# EAGLE schematic SparkySpecialK (EAGLE 6.5.0)
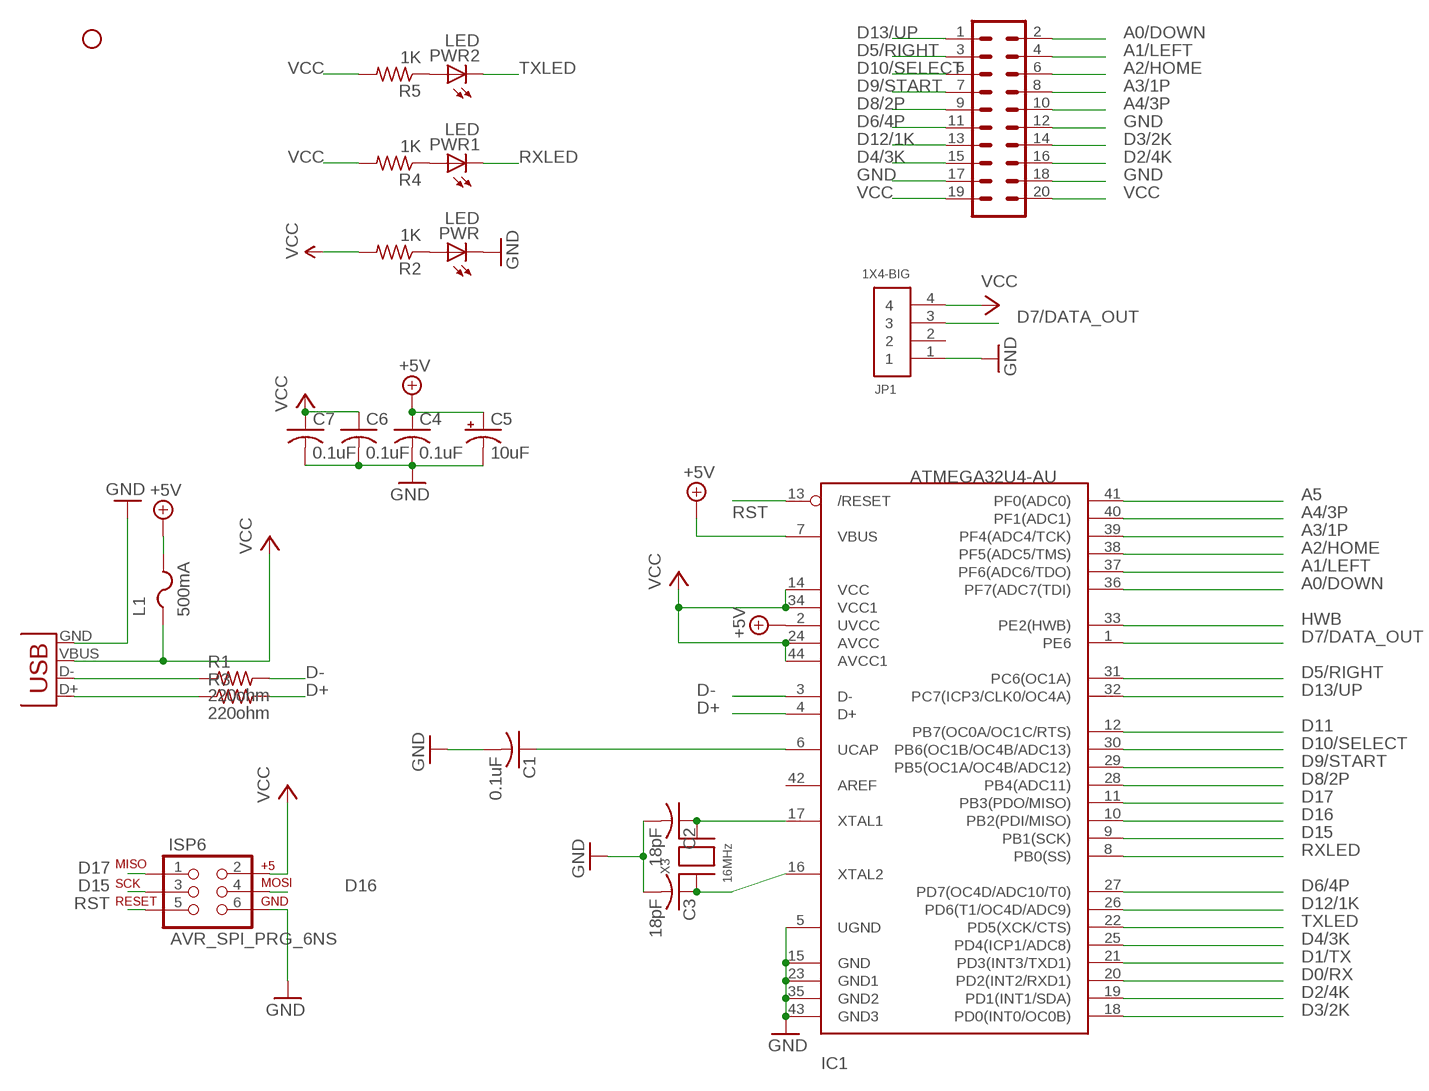
[diagram p0: schematic, sheet 1]

## Parts
C1  0.1uF  C-USC0805K  [C0805K]
C2  18pF  C-USC0805K  [C0805K]
C3  18pF  C-USC0805K  [C0805K]
C4  0.1uF  C-USC0805K  [C0805K]
C5  10uF  CPOL-USA/3216-18R  [A/3216-18R]
C6  0.1uF  C-USC0805K  [C0805K]
C7  0.1uF  C-USC0805K  [C0805K]
CN1  MiniB USB  USBSMD  [USB-MINIB]
IC1  ATMEGA32U4-AU  [TQFP44]
ISP6  AVR_SPI_PRG_6NS  [2X3-NS]
JP1  1X4-BIG  [1X04-BIG]
JP2  STAND-OFF  [STAND-OFF]
L1  500mA  PTCFUSE-1206  [R1206]
PWR  LED  LEDCHIPLED_0805  [CHIPLED_0805]
PWR1  LED  LEDCHIPLED_0805  [CHIPLED_0805]
PWR2  LED  LEDCHIPLED_0805  [CHIPLED_0805]
R1  220ohm  R-US_R0805  [R0805]
R2  1K  R-US_R0805  [R0805]
R3  220ohm  R-US_R0805  [R0805]
R4  1K  R-US_R0805  [R0805]
R5  1K  R-US_R0805  [R0805]
U$1  M10X2NOSILK  [2X10_NOSILK]
X3  16MHz  XTALNX5032  [NX5032]

## Nets
+5V: C4.1 C5.+ IC1.2(UVCC) IC1.7(VBUS) L1.2
A0/DOWN: IC1.36(PF7(ADC7(TDI)) U$1.2
A1/LEFT: IC1.37(PF6(ADC6/TDO)) U$1.4
A2/HOME: IC1.38(PF5(ADC5/TMS)) U$1.6
A3/1P: IC1.39(PF4(ADC4/TCK)) U$1.8
A4/3P: IC1.40(PF1(ADC1)) U$1.10
A5: IC1.41(PF0(ADC0))
D0/RX: IC1.20(PD2(INT2/RXD1))
D1/TX: IC1.21(PD3(INT3/TXD1))
D2/4K: IC1.19(PD1(INT1/SDA)) U$1.16
D3/2K: IC1.18(PD0(INT0/OC0B)) U$1.14
D4/3K: IC1.25(PD4(ICP1/ADC8)) U$1.15
D5/RIGHT: IC1.31(PC6(OC1A)) U$1.3
D6/4P: IC1.27(PD7(OC4D/ADC10/T0)) U$1.11
D7/DATA_OUT: IC1.1(PE6) JP1.3
D8/2P: IC1.28(PB4(ADC11)) U$1.9
D9/START: IC1.29(PB5(OC1A/OC4B/ADC12)) U$1.7
D10/SELECT: IC1.30(PB6(OC1B/OC4B/ADC13)) U$1.5
D11: IC1.12(PB7(OC0A/OC1C/RTS))
D12/1K: IC1.26(PD6(T1/OC4D/ADC9)) U$1.13
D13/UP: IC1.32(PC7(ICP3/CLK0/OC4A)) U$1.1
D15: IC1.9(PB1(SCK)) ISP6.3
D16: IC1.10(PB2(PDI/MISO)) ISP6.4
D17: IC1.11(PB3(PDO/MISO)) ISP6.1
D+: IC1.4(D+) R3.2
D-: IC1.3(D-) R1.2
GND: C1.2 C2.2 C3.2 C4.2 C5.- C6.2 C7.2 CN1.GND IC1.5(UGND) IC1.15(GND) IC1.23(GND1) IC1.35(GND2) IC1.43(GND3) ISP6.6 JP1.1 PWR.C U$1.12 U$1.17 U$1.18
HWB: IC1.33(PE2(HWB))
N$2: PWR.A R2.1
N$3: CN1.D+ R3.1
N$4: C1.1 IC1.6(UCAP)
N$5: CN1.D- R1.1
N$6: PWR1.A R4.1
N$7: PWR2.A R5.1
N$8: C2.1 IC1.17(XTAL1) X3.P$2
N$9: C3.1 IC1.16(XTAL2) X3.P$1
RST: IC1.13(/RESET) ISP6.5
RXLED: IC1.8(PB0(SS)) PWR1.C
TXLED: IC1.22(PD5(XCK/CTS)) PWR2.C
VCC: C6.1 C7.1 CN1.VBUS IC1.14(VCC) IC1.24(AVCC) IC1.34(VCC1) IC1.44(AVCC1) ISP6.2 JP1.4 L1.1 R2.2 R4.2 R5.2 U$1.19 U$1.20
Unconnected: IC1.42(AREF) JP1.2

## Library data of the parts
C1-C4 C6 C7 = adafruit:C-US: CAPACITOR, American symbol
C5 = adafruit:CPOL-US: POLARIZED CAPACITOR, American symbol
CN1 = SparkFun-Connectors:USB: USB Connectors USB-B-PTH is fully proven SKU : PRT-00139/CONN-08278 USB-miniB is fully proven SKU : PRT-00587 USB-A-PCB is untested. USB-A-H is throughly reviewed, but untested. Spark Fun Electronics SKU : PRT-00437 USB-B-SMT is throughly reviewed, but untested. Needs silkscreen touching up. USB-A-S has not been used/tested USB-MB-H has not been used/tested USB-MICROB has been used. CONN-09505
IC1 = adaprog:ATMEGA32U4
ISP6 = SparkFun:AVR_SPI_PRG_6: AVR ISP 6 Pin This is the reduced ISP connector for AVR programming. Common on Arduino. This footprint will take up less PCB space and can be used with a 10-pin to 6-pin adapter such as SKU: BOB-08508
JP1 = adafruit:1X4: 4-pin connector
JP2 = SparkFun:STAND-OFF: Stand Off This is the mechanical footprint for a #4 phillips button head screw. Use the keepout ring to avoid running the screw head into surrounding components. SKU : PRT-00447
L1 = adafruit:PTCFUSE: PTC fuses, resettable thermistors
PWR PWR1 PWR2 = adafruit:LED: LED OSRAM: - CHIPLED LG R971, LG N971, LY N971, LG Q971, LY Q971, LO R971, LY R971 LH N974, LH R974 LS Q976, LO Q976, LY Q976 LO Q996 - Hyper CHIPLED LW Q18S LB Q993, LB Q99A, LB R99A - SideLED LS A670, LO A670, LY A670, LG A670, LP A670 LB A673, LV A673, LT A673, LW A673 LH A674 LY A675 LS A676, LA A676, LO A676, LY A676, LW A676 LS A679, LY A679, LG A679 - Hyper Micro SIDELED® LS Y876, LA Y876, LO Y876, LY Y876 LT Y87S - SmartLED LW L88C, LW L88S LB L89C, LB L89S, LG L890 LS L89K, LO L89K, LY L89K LS L896, LA L896, LO L896, LY L896 - TOPLED LS T670, LO T670, LY T670, LG T670, LP T670 LSG T670, LSP T670, LSY T670, LOP T670, LYG T670 LG T671, LOG T671, LSG T671 LB T673, LV T673, LT T673, LW T673 LH T674 LS T676, LA T676, LO T676, LY T676, LB T676, LH T676, LSB T676, LW T676 LB T67C, LV T67C, LT T67C, LS T67K, LO T67K, LY T67K, LW E67C LS E67B, LA E67B, LO E67B, LY E67B, LB E67C, LV E67C, LT E67C LW T67C LS T679, LY T679, LG T679 LS T770, LO T770, LY T770, LG T770, LP T770 LB T773, LV T773, LT T773, LW T773 LH T774 LS E675, LA E675, LY E675, LS T675 LS T776, LA T776, LO T776, LY T776, LB T776 LHGB T686 LT T68C, LB T68C - Hyper Mini TOPLED® LB M676 - Mini TOPLED Santana® LG M470 LS M47K, LO M47K, LY M47K Source: http://www.osram.convergy.de/
R1-R5 = adafruit:R-US_: RESISTOR, American symbol
U$1 = SparkFun:M10X2: This was SPECIALLY designed to be used with our Graphic LCD Backpack. Be sure you want to use this! It is not only staggered on each line of header holes, but IT IS ALSO offset of the center point of the top and bottom lines by 5 mil. This causes the headers to lock into place on the "standard" footprint on the LCD screen. The extra squares on the tdocu layer are there simply to reference other pins (if you were to actually populate a longer header than ten long - this is what we do with the backpacks).
X3 = adaprog:XTAL